# EAGLE design V1 (EAGLE 9.6.2)

## Sheet 1 of 2
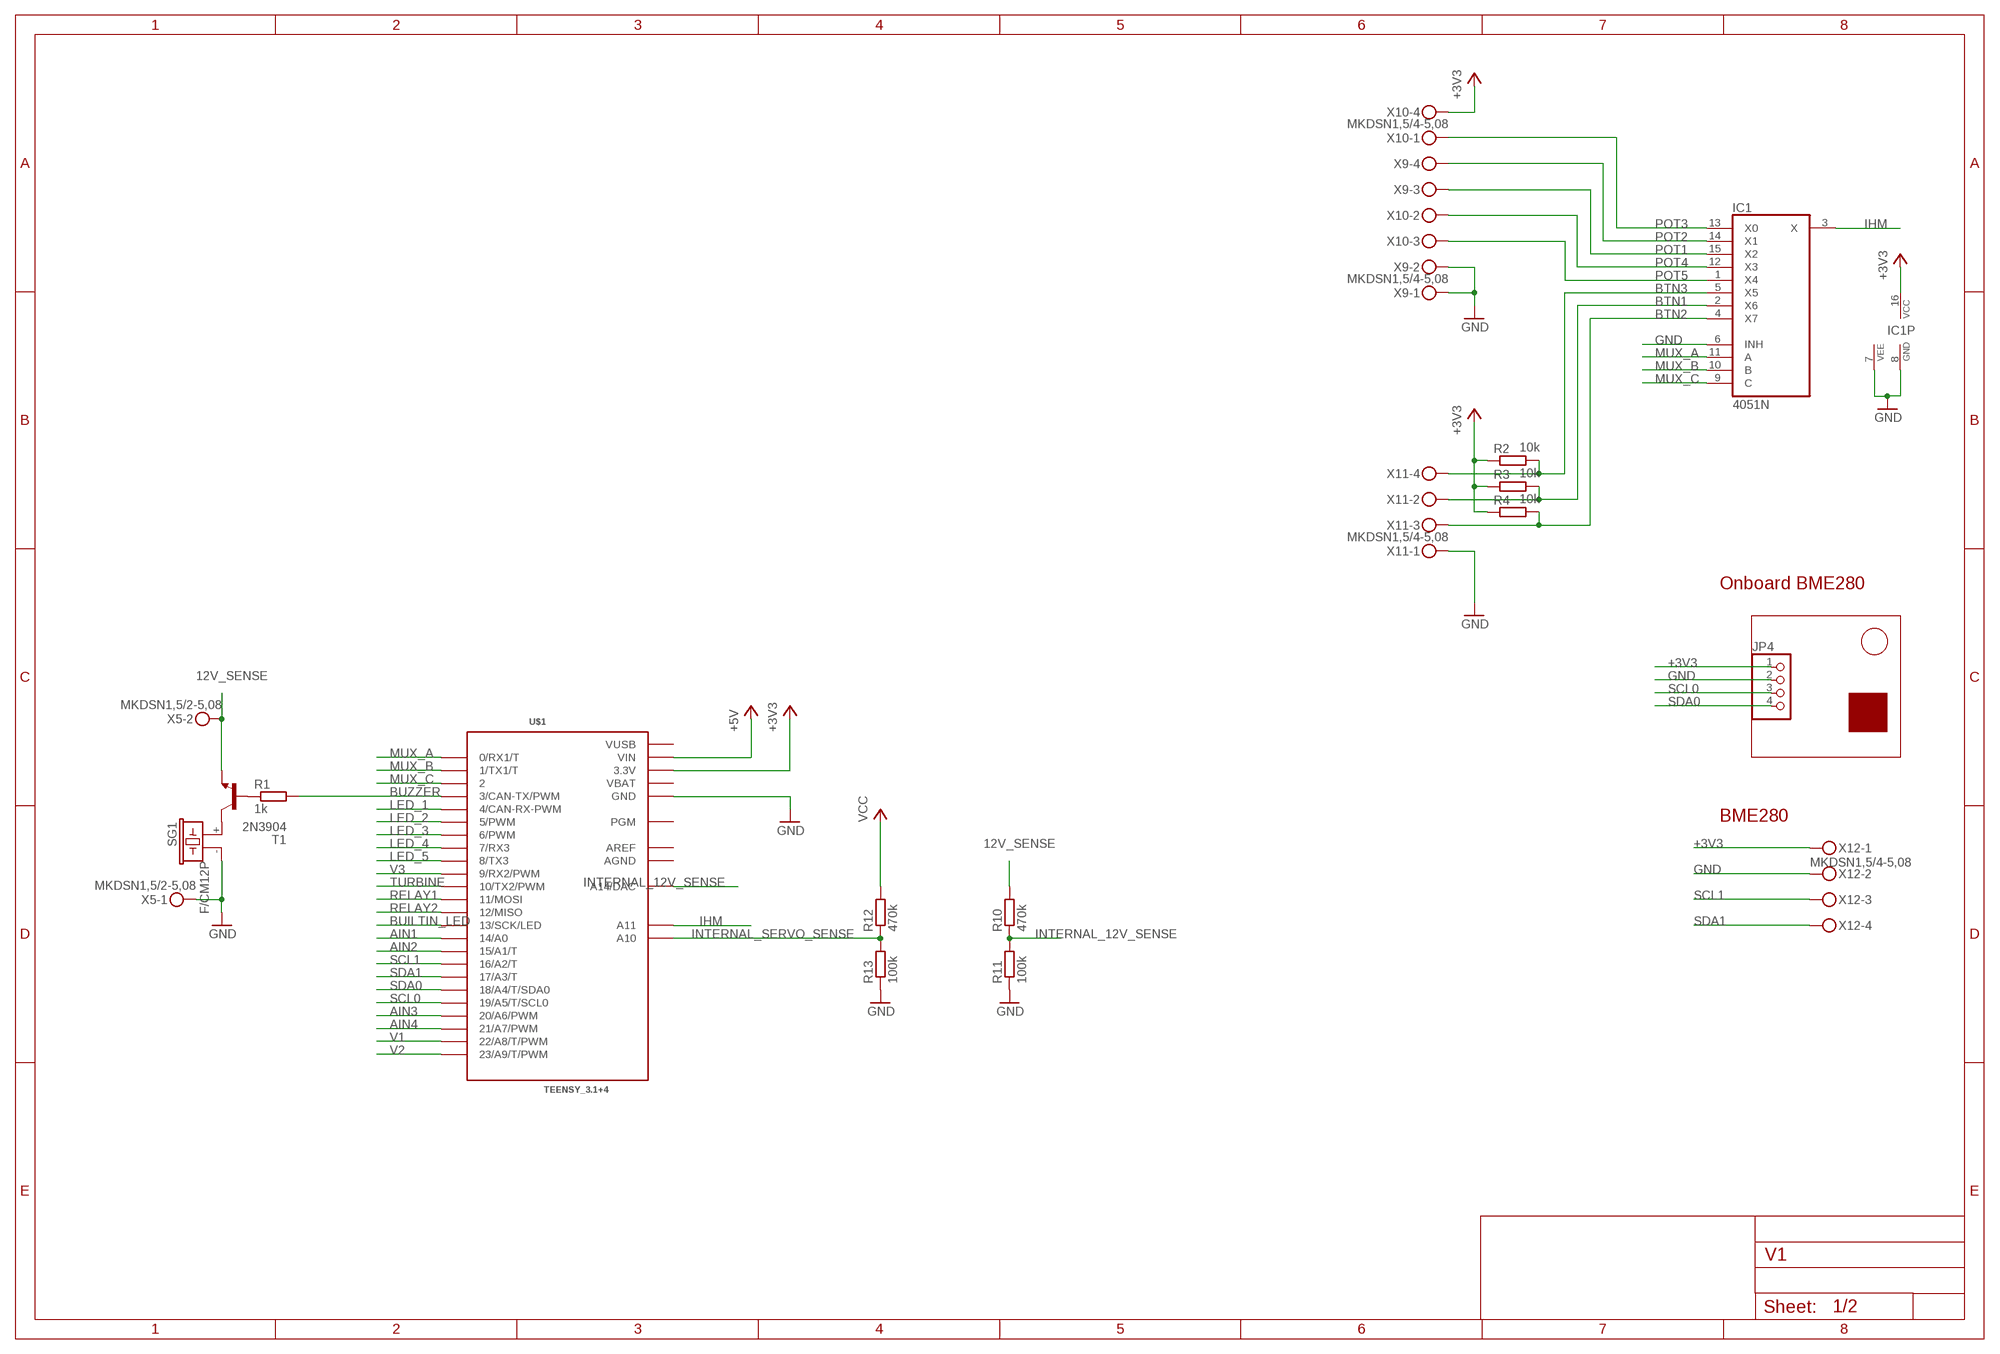
[diagram p0: schematic, sheet 1]

### Parts
IC1  4051N  [DIL16]
JP4  PINHD-1X4  [1X04]
R1  1k  R-EU_0207/15  [0207/15]
R2  10k  R-EU_0204/5  [0204/5]
R3  10k  R-EU_0204/5  [0204/5]
R4  10k  R-EU_0204/5  [0204/5]
R10  470k  R-EU_0204/5  [0204/5]
R11  100k  R-EU_0204/5  [0204/5]
R12  470k  R-EU_0204/7  [0204/7]
R13  100k  R-EU_0204/7  [0204/7]
SG1  F/CM12P  [F/CM12P]
T1  2N3904  [TO92]
U$1  TEENSY_3.1+4  [TEENSY_3.1+4]
X5  MKDSN1,5/2-5,08  [MKDSN1,5/2-5,08]
X9  MKDSN1,5/4-5,08  [MKDSN1,5/4-5,08]
X10  MKDSN1,5/4-5,08  [MKDSN1,5/4-5,08]
X11  MKDSN1,5/4-5,08  [MKDSN1,5/4-5,08]
X12  MKDSN1,5/4-5,08  [MKDSN1,5/4-5,08]

### Nets
12V_SENSE: R10.2 T1.3(E) X5.2
+3V3: IC1.16(VCC) JP4.1 R2.1 R3.1 R4.1 U$1.3.3V U$1.3.3V1(3.3V) X10.4 X12.1 ; also sheet 2
+5V: U$1.VIN ; also sheet 2
AIN1: U$1.14/A0 ; also sheet 2
AIN2: U$1.15/A1(15/A1/T) ; also sheet 2
AIN3: U$1.20/A6(20/A6/PWM) ; also sheet 2
AIN4: U$1.21/A7(21/A7/PWM) ; also sheet 2
BTN1: IC1.2(X6) R3.2 X11.2
BTN2: IC1.4(X7) R4.2 X11.3
BTN3: IC1.5(X5) R2.2 X11.4
BUILTIN_LED: U$1.13(13/SCK/LED)
BUZZER: R1.2 U$1.3(3/CAN-TX/PWM)
GND: IC1.6(INH) IC1.7(VEE) IC1.8(GND) JP4.2 R11.1 R13.1 SG1.- U$1.GND U$1.GND1(GND) X5.1 X9.1 X9.2 X11.1 X12.2 ; also sheet 2
IHM: IC1.3(X) U$1.A11
INTERNAL_12V_SENSE: R10.1 R11.2 U$1.A14(A14/DAC)
INTERNAL_SERVO_SENSE: R12.1 R13.2 U$1.A10
LED_1: U$1.4(4/CAN-RX-PWM) ; also sheet 2
LED_2: U$1.5(5/PWM) ; also sheet 2
LED_3: U$1.6(6/PWM) ; also sheet 2
LED_4: U$1.7(7/RX3) ; also sheet 2
LED_5: U$1.8(8/TX3) ; also sheet 2
MUX_A: IC1.11(A) U$1.0(0/RX1/T)
MUX_B: IC1.10(B) U$1.1(1/TX1/T)
MUX_C: IC1.9(C) U$1.2
N$3: R1.1 T1.2(B)
N$7: SG1.+ T1.1(C)
POT1: IC1.15(X2) X9.3
POT2: IC1.14(X1) X9.4
POT3: IC1.13(X0) X10.1
POT4: IC1.12(X3) X10.2
POT5: IC1.1(X4) X10.3
RELAY1: U$1.11(11/MOSI) ; also sheet 2
RELAY2: U$1.12(12/MISO) ; also sheet 2
SCL0: JP4.3 U$1.19/A5(19/A5/T/SCL0)
SCL1: U$1.16/A2(16/A2/T) X12.3
SDA0: JP4.4 U$1.18/A4(18/A4/T/SDA0)
SDA1: U$1.17/A3(17/A3/T) X12.4
TURBINE: U$1.10(10/TX2/PWM) ; also sheet 2
V1: U$1.22/A8(22/A8/T/PWM) ; also sheet 2
V2: U$1.23/A9(23/A9/T/PWM) ; also sheet 2
V3: U$1.9(9/RX2/PWM) ; also sheet 2
VCC: R12.2 ; also sheet 2
Unconnected: U$1.PGM

### Notes on the sheet
- Onboard BME280
- BME280

## Sheet 2 of 2
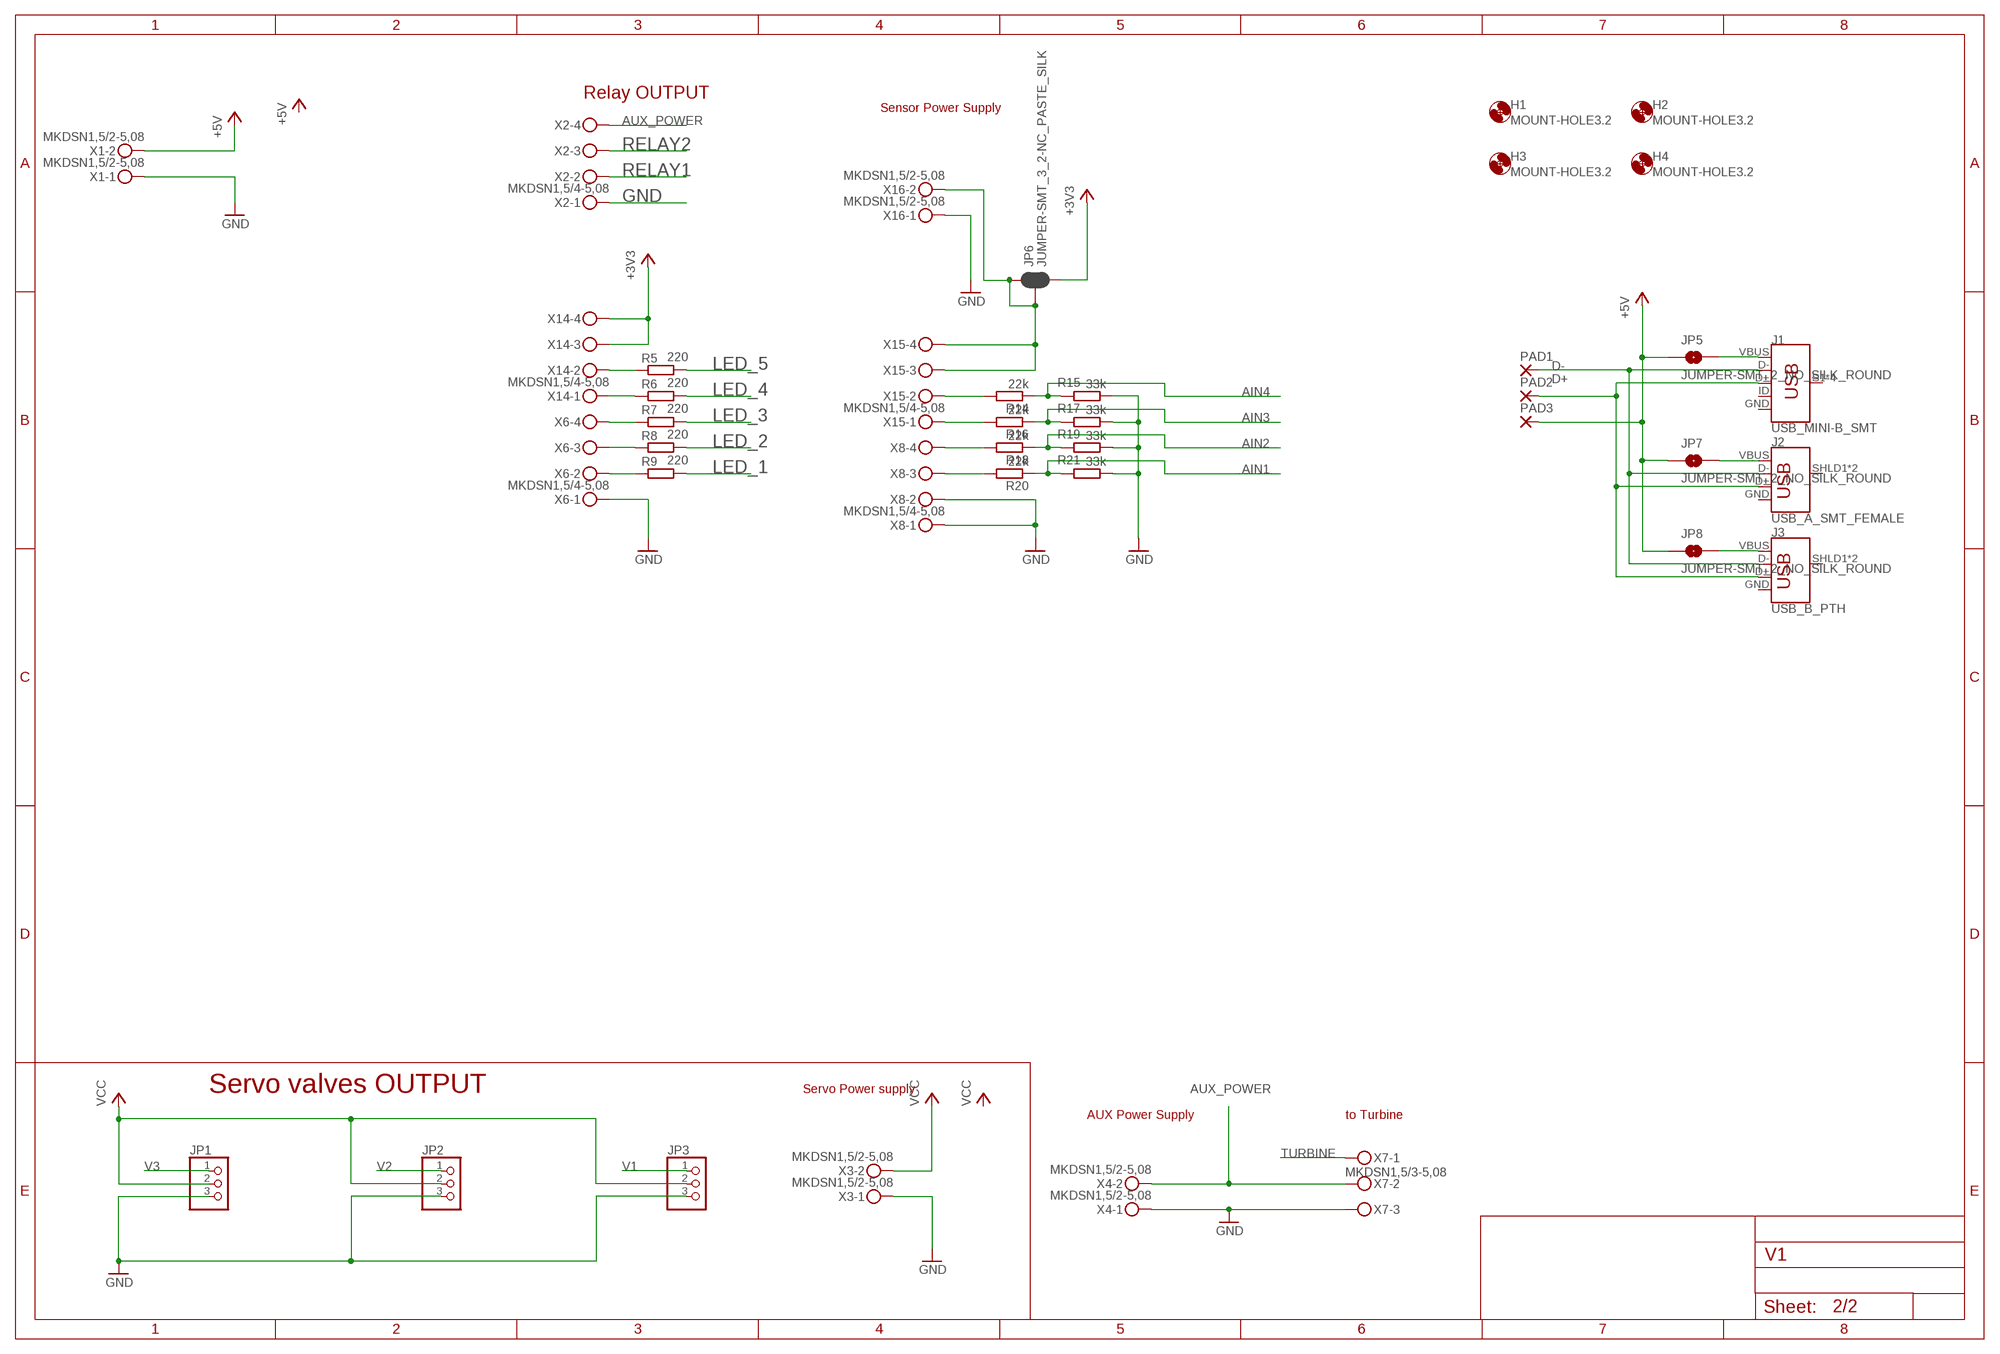
[diagram p1: schematic, sheet 2]

### Parts
H1  MOUNT-HOLE3.2  [3,2]
H2  MOUNT-HOLE3.2  [3,2]
H3  MOUNT-HOLE3.2  [3,2]
H4  MOUNT-HOLE3.2  [3,2]
J1  USB_MINI-B_SMT  [USB-MINIB]
J2  USB_A_SMT_FEMALE  [USB-A-S-SILK-FEMALE]
J3  USB_B_PTH  [USB-B-PTH]
JP1  PINHD-1X3/90  [1X03/90]
JP2  PINHD-1X3/90  [1X03/90]
JP3  PINHD-1X3/90  [1X03/90]
JP5  JUMPER-SMT_2_NO_SILK_ROUND  [SMT-JUMPER_2_NO_SILK_ROUND]
JP6  JUMPER-SMT_3_2-NC_PASTE_SILK  [SMT-JUMPER_3_2-NC_PASTE_SILK]
JP7  JUMPER-SMT_2_NO_SILK_ROUND  [SMT-JUMPER_2_NO_SILK_ROUND]
JP8  JUMPER-SMT_2_NO_SILK_ROUND  [SMT-JUMPER_2_NO_SILK_ROUND]
PAD1  3,17/1,3  [3,17/1,3]
PAD2  3,17/1,3  [3,17/1,3]
PAD3  3,17/1,3  [3,17/1,3]
R5  220  R-EU_0207/15  [0207/15]
R6  220  R-EU_0207/15  [0207/15]
R7  220  R-EU_0207/15  [0207/15]
R8  220  R-EU_0207/15  [0207/15]
R9  220  R-EU_0207/15  [0207/15]
R14  22k  R-EU_0207/12  [0207/12]
R15  33k  R-EU_0207/12  [0207/12]
R16  22k  R-EU_0207/12  [0207/12]
R17  33k  R-EU_0207/12  [0207/12]
R18  22k  R-EU_0207/12  [0207/12]
R19  33k  R-EU_0207/12  [0207/12]
R20  22k  R-EU_0207/12  [0207/12]
R21  33k  R-EU_0207/12  [0207/12]
X1  MKDSN1,5/2-5,08  [MKDSN1,5/2-5,08]
X2  MKDSN1,5/4-5,08  [MKDSN1,5/4-5,08]
X3  MKDSN1,5/2-5,08  [MKDSN1,5/2-5,08]
X4  MKDSN1,5/2-5,08  [MKDSN1,5/2-5,08]
X6  MKDSN1,5/4-5,08  [MKDSN1,5/4-5,08]
X7  MKDSN1,5/3-5,08  [MKDSN1,5/3-5,08]
X8  MKDSN1,5/4-5,08  [MKDSN1,5/4-5,08]
X14  MKDSN1,5/4-5,08  [MKDSN1,5/4-5,08]
X15  MKDSN1,5/4-5,08  [MKDSN1,5/4-5,08]
X16  MKDSN1,5/2-5,08  [MKDSN1,5/2-5,08]

### Nets
+3V3: JP6.3 X14.3 X14.4 ; also sheet 1
+5V: JP5.1 JP7.1 JP8.1 PAD3.1(P) X1.2 ; also sheet 1
AIN1: R20.1 R21.2 ; also sheet 1
AIN2: R18.1 R19.2 ; also sheet 1
AIN3: R16.1 R17.2 ; also sheet 1
AIN4: R14.1 R15.2 ; also sheet 1
AUX_POWER: X2.4 X4.2 X7.2
D+: J1.D+ J2.D+ J3.D+ PAD2.1(P)
D-: J1.D- J2.D- J3.D- PAD1.1(P)
GND: JP1.3 JP2.3 JP3.3 R15.1 R17.1 R19.1 R21.1 X1.1 X2.1 X3.1 X4.1 X6.1 X7.3 X8.1 X8.2 X16.1 ; also sheet 1
LED_1: R9.2 ; also sheet 1
LED_2: R8.2 ; also sheet 1
LED_3: R7.2 ; also sheet 1
LED_4: R6.2 ; also sheet 1
LED_5: R5.2 ; also sheet 1
N$1: R5.1 X14.2
N$2: R6.1 X14.1
N$4: R7.1 X6.4
N$5: R8.1 X6.3
N$6: R9.1 X6.2
N$9: J1.VBUS JP5.2
N$10: R20.2 X8.3
N$11: R18.2 X8.4
N$12: R16.2 X15.1
N$13: R14.2 X15.2
N$14: JP6.1 JP6.2 X15.3 X15.4 X16.2
N$15: J2.VBUS JP7.2
N$16: J3.VBUS JP8.2
RELAY1: X2.2 ; also sheet 1
RELAY2: X2.3 ; also sheet 1
TURBINE: X7.1 ; also sheet 1
V1: JP3.1 ; also sheet 1
V2: JP2.1 ; also sheet 1
V3: JP1.1 ; also sheet 1
VCC: JP1.2 JP2.2 JP3.2 X3.2 ; also sheet 1
Unconnected: J1.ID J1.S1(SHIELD) J1.S2(SHIELD) J1.S3(SHIELD) J1.S4(SHIELD) J2.SHLD1(SHIELD) J2.SHLD2(SHIELD) J3.SHLD1(SHIELD) J3.SHLD2(SHIELD)

### Notes on the sheet
- Relay OUTPUT
- Sensor Power Supply
- Servo valves OUTPUT | Servo Power supply
- AUX Power Supply | to Turbine

## Power pins joined to a net without a drawn wire
AGND: U$1.AGND
AREF: U$1.AREF
GND: J1.GND J2.GND J3.GND
VBAT: U$1.VBAT
VUSB: U$1.VUSB

## Library data of the parts
H1-H4 = holes:MOUNT-HOLE: MOUNTING HOLE with drill center marker
IC1 = 40xx:4051: 8-channel ANALOG MULTIPLEXER
J1 = SparkFun-Connectors:USB_MINI-B: USB type Mini-B Connector Breaks out 5th pin, and includes shield pins if needed. SparkFun Products: SparkFun FTDI Basic Breakout <https://www.sparkfun.com/products/9716> SparkFun XBee Explorer USB <https://www.sparkfun.com/products/11812> SparkFun Redboard <https://www.sparkfun.com/products/12757>; PROD_ID: CONN-08193; SF_ID: PRT-00587
J2 = SparkFun-Connectors:USB_A: USB-A Connector Male and female variants, as well as PTH and SMT variants SparkFun Products: SparkFun XBee Explorer Dongle <https://www.sparkfun.com/products/11697> PTH Male SparkFun MicroView-USB Programmer <https://www.sparkfun.com/products/12924> SMT Male SparkFun USB Type A Female Breakout <https://www.sparkfun.com/products/12700> SMT Female; PROD_ID: CONN-09520; SF_ID: PRT-09011
J3 = SparkFun-Connectors:USB_B: USB Type B Connector SparkFun Products: SparkFun Stepoko <https://www.sparkfun.com/products/13899> PTH; PROD_ID: CONN-08278; SF_ID: PRT-00139
JP1-JP3 = pinhead:PINHD-1X3: PIN HEADER
JP4 = pinhead:PINHD-1X4: PIN HEADER
JP5 JP7 JP8 = SparkFun-Jumpers:JUMPER-SMT_2_NO: Normally open jumper This jumper has two pads in close proximity to each other. Apply solder to close the connection. Round pads are easier to solder for beginners, but are a lot larger. SparkFun Product that uses the round pads: SparkFun EL Sequencer <https://www.sparkfun.com/products/12781>
JP6 = SparkFun-Jumpers:JUMPER-SMT_3_2-NC_PASTE: Normally closed solder jumper (2 of 2 connections) This jumper has an aperture in the stencil to allow solder paste to bridge both connections. Both connections are normally closed (NC). Wick off the solder to open the connection(s). Reapply solder to reclose the connection(s).
PAD1-PAD3 = wirepad:3,17/1,3: THROUGH-HOLE PAD
R1-R21 = rcl:R-EU_: RESISTOR, European symbol; SPICEPREFIX: R
SG1 = buzzer:F/CM12P: BUZZER Source: Buerklin; OC_FARNELL: unknown; OC_NEWARK: unknown
T1 = transistor-neu-to92:2N3904: NPN TRANSISTOR
U$1 = Teensy_3_Series_Board_v1.0:TEENSY_3.1+4: Footprint for Teensy 3.1 board using all through-holes, i.e. the entire perimeter plus the 4 through-holes inboard (A10,A11,AREF, VUSB)
X1 X3-X5 X16 = con-phoenix-508:MKDSN1,5/2-5,08: MKDSN 1,5/ 2-5,08 Printklemme Nennstrom: 13,5 A Nennspannung: 250 V Rastermaß: 5,08 mm Polzahl: 2 Anschlussart: Schraubanschluss Montage: Löten Anschlussrichtung Leiter/Platine: 0 ° Artikelnummer: 1729128 Source: http://eshop.phoenixcontact.com .. 1729128.pdf
X2 X6 X8-X12 X14 X15 = con-phoenix-508:MKDSN1,5/4-5,08: MKDSN 1,5/ 4-5,08 Printklemme Nennstrom: 13,5 A Nennspannung: 250 V Rastermaß: 5,08 mm Polzahl: 4 Anschlussart: Schraubanschluss Montage: Löten Anschlussrichtung Leiter/Platine: 0 ° Artikelnummer: 1729144 Source: http://eshop.phoenixcontact.com .. 1729144.pdf
X7 = con-phoenix-508:MKDSN1,5/3-5,08: MKDSN 1,5/ 3-5,08 Printklemme Nennstrom: 13,5 A Nennspannung: 250 V Rastermaß: 5,08 mm Polzahl: 3 Anschlussart: Schraubanschluss Montage: Löten Anschlussrichtung Leiter/Platine: 0 ° Artikelnummer: 1729131 Source: http://eshop.phoenixcontact.com .. 1729131.pdf

## Board
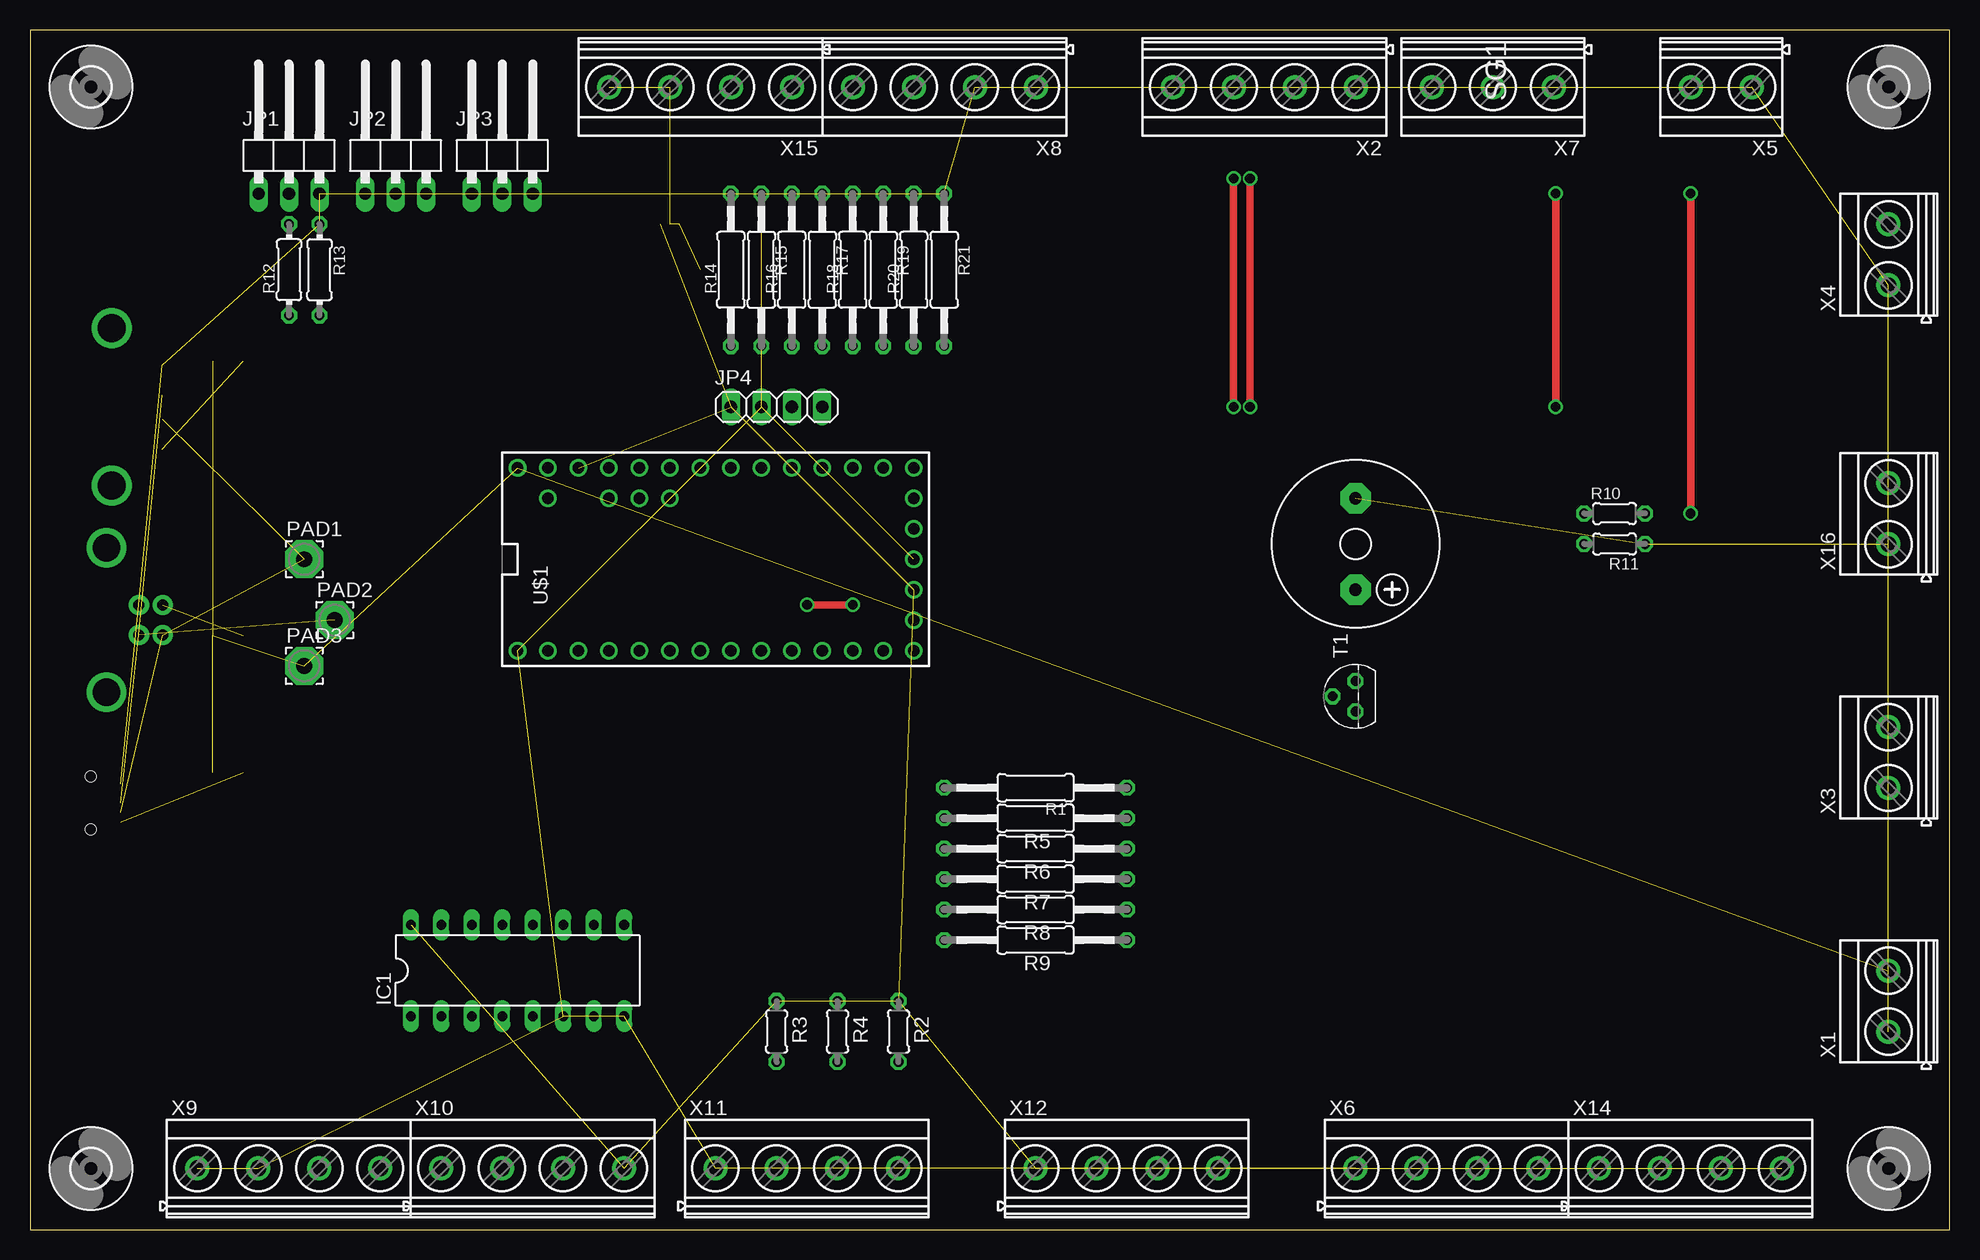
[diagram p2: board, top side]
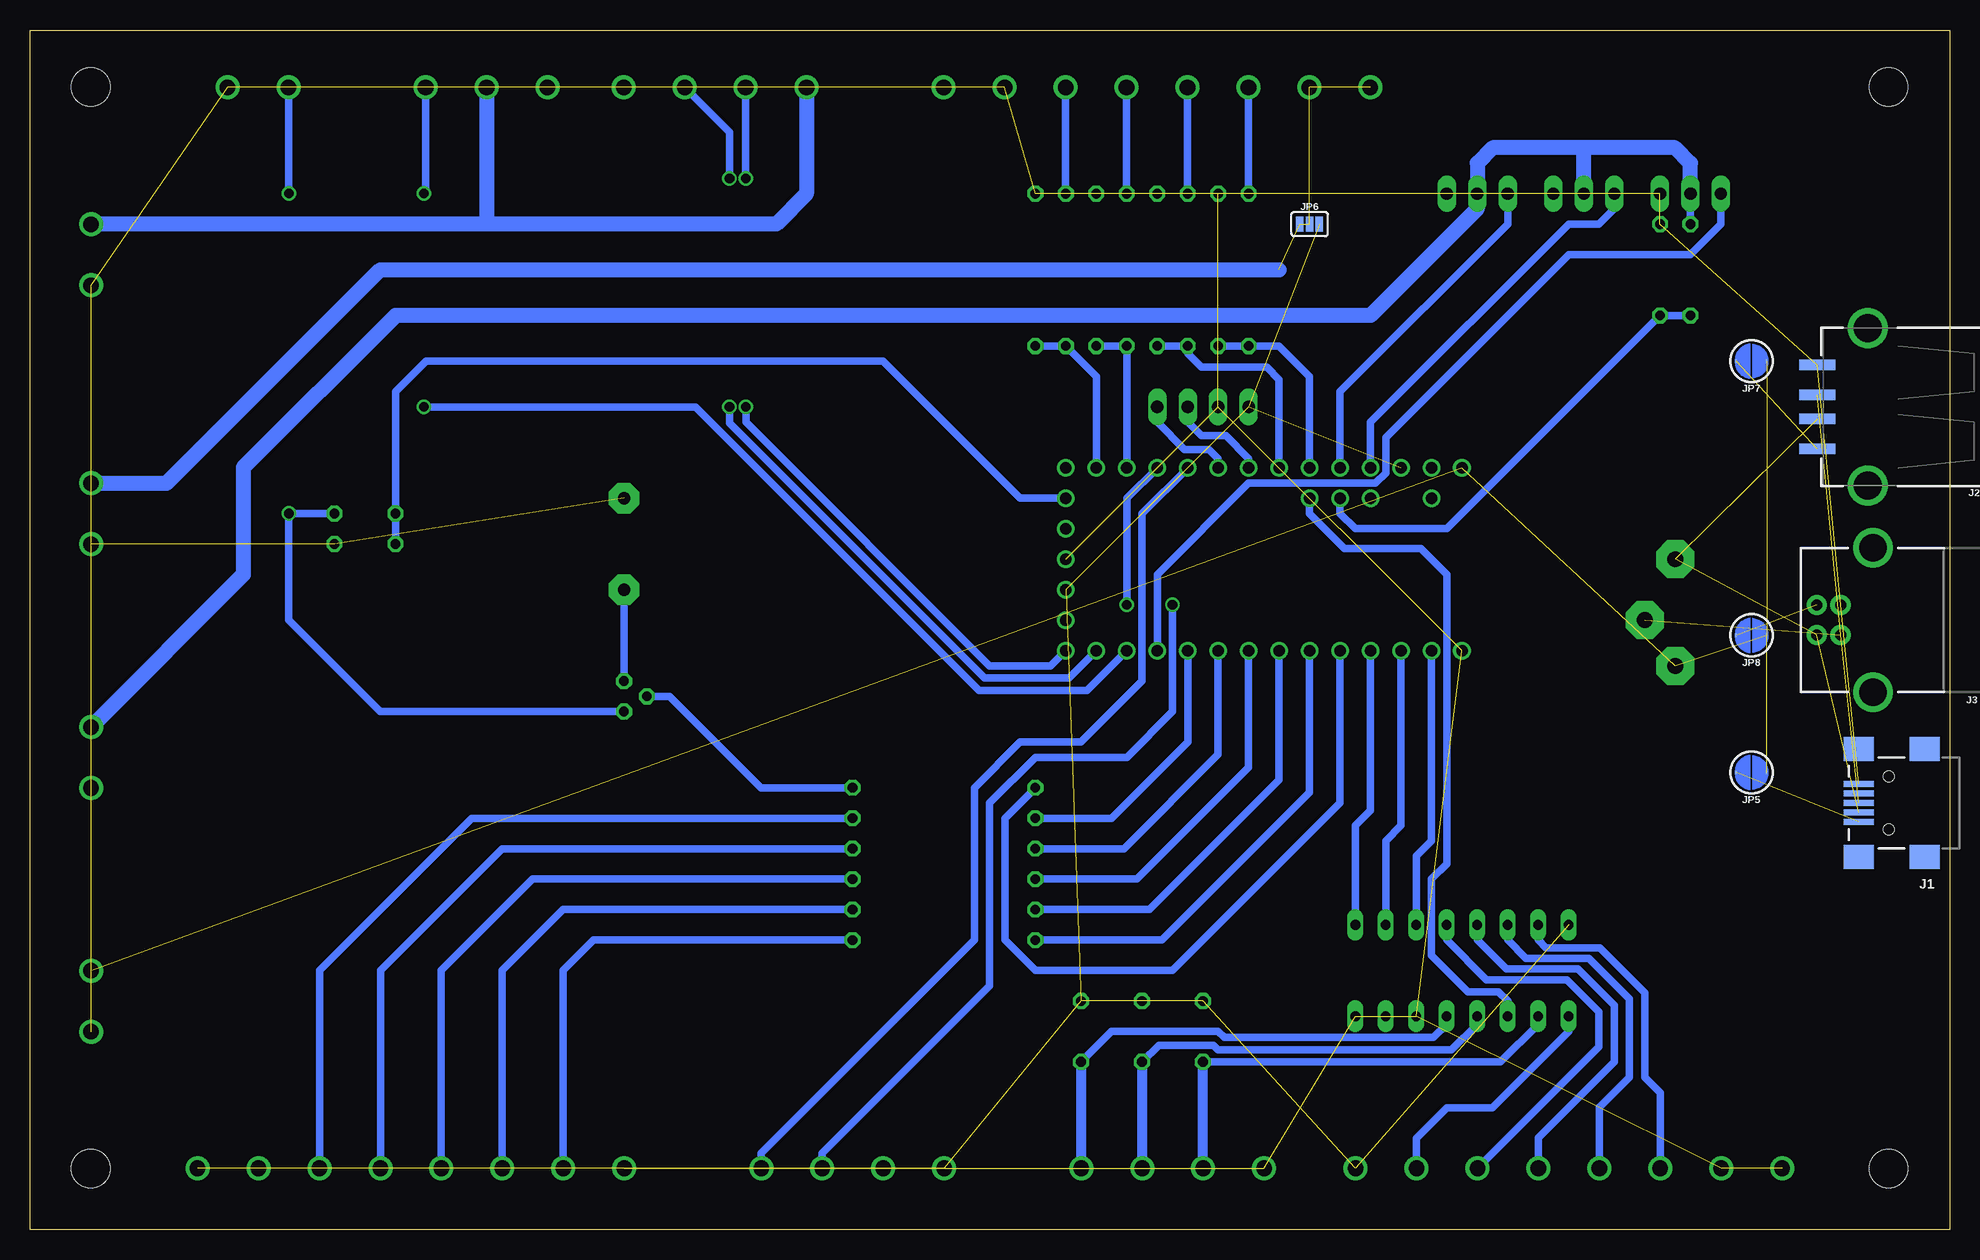
[diagram p3: board, bottom side, seen from below]

Size 160 x 100 mm. Coordinates in mm from the lower left corner, seen from the top.
Outline: 0,0 160,0 160,100 0,100 0,0
Copper layers (1*16): Top 0.035mm / dielectric 1.5mm / Bottom 0.035mm
Design rules "default": minimum track width 6mil, minimum drill 0.35mm, track to track 6mil, track to pad 6mil, pad to pad 6mil, via to via 6mil, smd to smd 6mil, copper to edge 40mil, drill to drill 6mil, minimum pad ring 10mil, minimum via ring 8mil, stop-mask expansion 4mil, vias tented up to drill 0mil, thermal gap 10mil

### Footprints (pad centres in the part's own frame; a part is rotated, then mirrored left to right if it is on the bottom)
3,2 = hole 3.2: 0,0
DIL16 = drill 0.813 long: 1 -8.89,-3.81; 2 -6.35,-3.81; 3 -3.81,-3.81; 4 -1.27,-3.81; 5 1.27,-3.81; 6 3.81,-3.81; 7 6.35,-3.81; 8 8.89,-3.81; 9 8.89,3.81; 10 6.35,3.81; 11 3.81,3.81; 12 1.27,3.81; 13 -1.27,3.81; 14 -3.81,3.81; 15 -6.35,3.81; 16 -8.89,3.81
USB-MINIB = smd 2.5 x 0.5: D+ 2.5,0; D- 2.5,0.8; GND 2.5,-1.6; ID 2.5,-0.8; VBUS 2.5,1.6 | smd 2.5 x 2: S1 -3,4.5; S2 2.5,4.5; S3 -3,-4.5; S4 2.5,-4.5 | hole 0.9: 0,2.2; 0,-2.2
USB-A-S-SILK-FEMALE = smd 3 x 0.9: D+ 7.212,-1; D- 7.212,1; GND 7.212,-3.5; VBUS 7.212,3.5 | drill 2.311: SHLD1 3,-6.566; SHLD2 3,6.566
USB-B-PTH = drill 0.914 pad 1.676: D+ 4,1.25; D- 5.981,1.25; GND 4,-1.25; VBUS 5.981,-1.25 | drill 2.286: SHLD1 1.282,-6.02; SHLD2 1.282,6.02
1X03/90 = drill 1.016 long: 1 -2.54,-3.81; 2 0,-3.81; 3 2.54,-3.81
1X04 = drill 1.016 long: 1 -3.81,0; 2 -1.27,0; 3 1.27,0; 4 3.81,0
SMT-JUMPER_2_NO_SILK_ROUND = smd 0.152 x 0.305: 1 -1.27,0; 2 1.27,0
SMT-JUMPER_3_2-NC_PASTE_SILK = smd 0.635 x 1.27: 1 -0.813,0; 2 0,0; 3 0.813,0
3,17/1,3 = drill 1.321 pad 3.175 octagon: 1 0,0
0207/15 = drill 0.813 octagon: 1 -7.62,0; 2 7.62,0
0204/5 = drill 0.813 octagon: 1 -2.54,0; 2 2.54,0
0204/7 = drill 0.813 octagon: 1 -3.81,0; 2 3.81,0
0207/12 = drill 0.813 octagon: 1 -6.35,0; 2 6.35,0
F/CM12P = drill 1.016 pad 2.54 octagon: + 3.81,0; - -3.81,0
TO92 = drill 0.813 octagon: 1 1.27,0; 2 0,1.905; 3 -1.27,0
TEENSY_3.1+4 = drill 0.965: 0 -7.62,15.24; 1 -7.62,12.7; 2 -7.62,10.16; 3 -7.62,7.62; 3.3V 7.62,12.7; 3.3V1 -2.54,-15.24; 4 -7.62,5.08; 5 -7.62,2.54; 6 -7.62,0; 7 -7.62,-2.54; 8 -7.62,-5.08; 9 -7.62,-7.62; 10 -7.62,-10.16; 11 -7.62,-12.7; 12 -7.62,-15.24; 13 7.62,-15.24; 14/A0 7.62,-12.7; 15/A1 7.62,-10.16; 16/A2 7.62,-7.62; 17/A3 7.62,-5.08; 18/A4 7.62,-2.54; 19/A5 7.62,0; 20/A6 7.62,2.54; 21/A7 7.62,5.08; 22/A8 7.62,7.62; 23/A9 7.62,10.16; A10 5.08,7.62; A11 5.08,5.08; A14 5.08,-15.24; AGND 7.62,15.24; AREF 5.08,10.16; GND -7.62,17.78; GND1 0,-15.24; PGM 2.54,-15.24; VBAT -5.08,-15.24; VIN 7.62,17.78; VUSB 5.08,15.24
MKDSN1,5/2-5,08 = drill 1.3 pad 2: 1 -2.561,0.025; 2 2.519,0.025
MKDSN1,5/4-5,08 = drill 1.3 pad 2: 1 -7.641,0.025; 2 -2.561,0.025; 3 2.519,0.025; 4 7.599,0.025
MKDSN1,5/3-5,08 = drill 1.3 pad 2: 1 -7.641,0.025; 2 -2.561,0.025; 3 2.519,0.025

### Placement (x,y rotation side)
H1  5.08,5.08 0 top
H2  154.94,5.08 0 top
H3  5.08,95.25 0 top
H4  154.94,95.25 0 top
IC1  40.64,21.59 0 top
J1  5.08,35.56 180 bottom
J2  3.81,68.58 180 bottom
J3  5.08,50.8 180 bottom
JP1  21.59,90.17 0 top
JP2  30.48,90.17 0 top
JP3  39.37,90.17 0 top
JP4  62.23,68.58 0 top
JP5  16.51,38.1 180 bottom
JP6  53.34,83.82 0 bottom
JP7  16.51,72.39 180 bottom
JP8  16.51,49.53 180 bottom
PAD1  22.86,55.88 0 top
PAD2  25.4,50.8 0 top
PAD3  22.86,46.99 0 top
R1  83.82,36.83 180 top
R2  72.39,16.51 270 top
R3  62.23,16.51 270 top
R4  67.31,16.51 270 top
R5  83.82,34.29 180 top
R6  83.82,31.75 180 top
R7  83.82,29.21 180 top
R8  83.82,26.67 180 top
R9  83.82,24.13 180 top
R10  132.08,59.69 0 top
R11  132.08,57.15 180 top
R12  21.59,80.01 90 top
R13  24.13,80.01 270 top
R14  58.42,80.01 90 top
R15  60.96,80.01 270 top
R16  63.5,80.01 90 top
R17  66.04,80.01 270 top
R18  68.58,80.01 90 top
R19  71.12,80.01 270 top
R20  73.66,80.01 90 top
R21  76.2,80.01 270 top
SG1  110.49,57.15 270 top
T1  110.49,44.45 90 top
U$1  58.42,55.88 90 top
X1  154.94,19.05 90 top
X2  102.87,95.25 180 top
X3  154.94,39.37 90 top
X4  154.94,81.28 90 top
X5  140.97,95.25 180 top
X6  118.11,5.08 0 top
X7  119.38,95.25 180 top
X8  76.2,95.25 180 top
X9  21.59,5.08 0 top
X10  41.91,5.08 0 top
X11  64.77,5.08 0 top
X12  91.44,5.08 0 top
X14  138.43,5.08 0 top
X15  55.88,95.25 180 top
X16  154.94,59.69 90 top

### Tracks (layer width: path | path; a pad name or v marks a point on that pad's centre or on a via)
12V_SENSE  (via drill 0.8)
  Top 0.61: v138.43,86.36 v138.43,59.69
  Bottom 0.61: X5.2 138.43,95.2 v138.43,86.36 | R10.2 v138.43,59.69 138.43,50.8 130.81,43.18 T1.3
+3V3  (11 unrouted)
+5V  (5 unrouted)
AIN1
  Bottom 0.61: R21.2 R20.1 71.12,71.12 U$1.14/A0
AIN2
  Bottom 0.61: R19.2 R18.1 U$1.15/A1
AIN3
  Bottom 0.61: R17.2 R16.1 63.5,73.03 62.36,71.88 56.9,71.88 55.88,70.87 U$1.20/A6
AIN4
  Bottom 0.61: R15.2 R14.1 55.88,73.66 53.34,71.12 U$1.21/A7
AUX_POWER
  Bottom 1.27: X2.4 95.27,86.34 97.79,83.82 121.92,83.82 | 121.92,83.82 154.89,83.82 X4.2 | X7.2 121.94,83.84 121.92,83.82
BTN1
  Bottom 0.61: IC1.2 34.29,17.12 37.44,13.97 R3.2
  Bottom 0.813: X11.2 62.21,13.95 R3.2
BTN2
  Bottom 0.61: IC1.4 39.37,17.12 41.5,14.99 59.18,14.99 60.96,14.99 61.34,15.37 65.91,15.37 R4.2
  Bottom 0.813: R4.2 67.31,5.13 X11.3
BTN3
  Bottom 0.61: R2.2 69.85,16.51 60.96,16.51 60.45,16 43.03,16 41.91,17.12 IC1.5
  Bottom 0.813: R2.2 72.37,13.95 X11.4
BUZZER
  Bottom 0.61: U$1.3 50.8,35.56 64.77,21.59 76.2,21.59 78.74,24.13 78.74,34.29 R1.2
D+  (3 unrouted)
D-  (3 unrouted)
GND  (32 unrouted)
IHM
  Bottom 0.61: U$1.A11 53.34,59.69 50.42,56.77 44.07,56.77 41.91,54.61 41.91,30.48 43.18,29.21 43.18,22.86 40.13,19.81 37.59,19.81 36.83,19.05 IC1.3
INTERNAL_12V_SENSE
  Bottom 0.61: R11.2 R10.1 129.54,69.85 127,72.39 88.9,72.39 77.47,60.96 U$1.A14
INTERNAL_SERVO_SENSE
  Bottom 0.61: U$1.A10 50.8,59.69 49.53,58.42 41.91,58.42 R13.2 R12.1
LED_1
  Bottom 0.61: U$1.4 53.34,36.43 65.64,24.13 R9.2
LED_2
  Bottom 0.61: U$1.5 55.88,37.48 66.69,26.67 R8.2
LED_3
  Bottom 0.61: U$1.6 58.42,38.54 67.75,29.21 R7.2
LED_4
  Bottom 0.61: U$1.7 60.96,39.59 68.8,31.75 R6.2
LED_5
  Bottom 0.61: U$1.8 63.5,40.64 69.85,34.29 R5.2
MUX_A
  Bottom 0.61: IC1.11 44.45,31.14 43.18,32.41 U$1.0
MUX_B
  Bottom 0.61: IC1.10 46.99,32.41 45.72,33.68 U$1.1
MUX_C
  Bottom 0.61: IC1.9 49.53,33.68 48.26,34.95 U$1.2
N$1
  Bottom 0.61: X14.2 135.87,21.61 123.19,34.29 R5.1
N$2
  Bottom 0.61: X14.1 130.79,21.61 120.65,31.75 R6.1
N$3
  Bottom 0.61: R1.1 99.06,36.83 106.68,44.45 T1.2
N$4
  Bottom 0.61: X6.4 125.71,21.61 118.11,29.21 R7.1
N$5
  Bottom 0.61: X6.3 120.63,21.61 115.57,26.67 R8.1
N$6
  Bottom 0.61: X6.2 115.55,21.61 113.03,24.13 R9.1
N$7
  Bottom 0.61: SG1.+ T1.1
N$9  (1 unrouted)
N$10
  Bottom 0.61: X8.3 73.68,86.38 R20.2
N$11
  Bottom 0.61: X8.4 68.6,86.38 R18.2
N$12
  Bottom 0.61: X15.1 63.52,86.38 R16.2
N$13
  Bottom 0.61: X15.2 58.44,86.38 R14.2
N$14  (4 unrouted)
  Bottom 1.27: X16.2 148.61,62.21 130.81,80.01 55.88,80.01
N$15  (1 unrouted)
N$16  (1 unrouted)
POT1
  Bottom 0.61: IC1.15 34.29,24.13 33.66,23.5 29.16,23.5 25.4,19.74 25.4,12.7 24.11,11.41 X9.3
POT2
  Bottom 0.61: IC1.14 36.83,24.13 35.31,22.61 30.06,22.61 26.67,19.21 26.67,12.7 29.19,10.19 X9.4
POT3
  Bottom 0.61: IC1.13 39.37,24.13 36.96,21.72 30.97,21.72 27.94,18.69 27.94,13.97 34.27,7.64 X10.1
POT4
  Bottom 0.61: IC1.12 41.91,24.13 38.61,20.83 31.88,20.83 29.21,18.16 29.21,15.24 X10.2
POT5
  Bottom 0.61: IC1.1 31.75,16.51 38.1,10.16 41.91,10.16 44.45,7.62 44.45,5.13 X10.3
RELAY1  (via drill 0.8)
  Top 0.61: v101.69,68.58 v101.69,87.63
  Bottom 0.61: U$1.11 73.41,45.97 80.45,45.97 101.69,67.21 v101.69,68.58 | X2.2 101.69,91.48 v101.69,87.63
RELAY2  (via drill 0.8)
  Top 0.61: v100.33,68.58 v100.33,87.63
  Bottom 0.61: U$1.12 74.93,46.99 80.01,46.99 100.33,67.31 v100.33,68.58 | X2.3 100.35,87.65 v100.33,87.63
SCL0
  Bottom 0.61: U$1.19/A5 58.42,64.26 60.33,66.17 62.36,66.17 63.5,67.31 JP4.3
SCL1  (via drill 0.8)
  Top 0.61: v64.77,52.07 v68.58,52.07
  Bottom 0.61: X12.3 93.98,5.13 93.98,6.35 80.01,20.32 80.01,35.56 76.2,39.37 68.58,39.37 64.77,43.18 v64.77,52.07 | U$1.16/A2 68.58,60.96 v68.58,52.07
SDA0
  Bottom 0.61: U$1.18/A4 60.96,64.26 61.72,65.02 63.75,65.02 66.04,67.31 JP4.4
SDA1
  Bottom 0.61: X12.4 99.06,5.13 99.06,6.35 81.28,24.13 81.28,36.83 77.47,40.64 72.39,40.64 67.31,45.72 67.31,59.69 U$1.17/A3
TURBINE  (via drill 0.8)
  Top 0.61: v127.18,86.36 v127.18,68.58
  Bottom 0.61: U$1.10 71.88,44.96 80.89,44.96 104.52,68.58 v127.18,68.58 | X7.1 127.02,86.52 v127.18,86.36
V1
  Bottom 0.61: JP3.1 36.83,83.82 50.8,69.85 U$1.22/A8
V2
  Bottom 0.61: U$1.23/A9 48.26,67.31 31.75,83.82 29.21,83.82 27.94,85.09 JP2.1
V3
  Bottom 0.61: U$1.9 66.04,54.61 58.42,62.23 47.84,62.23 46.99,63.08 46.99,66.04 31.75,81.28 21.59,81.28 19.05,83.82 JP1.1
VCC
  Bottom 0.61: JP1.2 R12.2
  Bottom 1.27: JP1.2 21.59,88.9 22.86,90.17 30.48,90.17 | JP2.2 30.48,90.17 | 30.48,90.17 38.1,90.17 39.37,88.9 JP3.2 39.37,85.09 48.26,76.2 129.54,76.2 142.22,63.52 142.22,54.59 X3.2